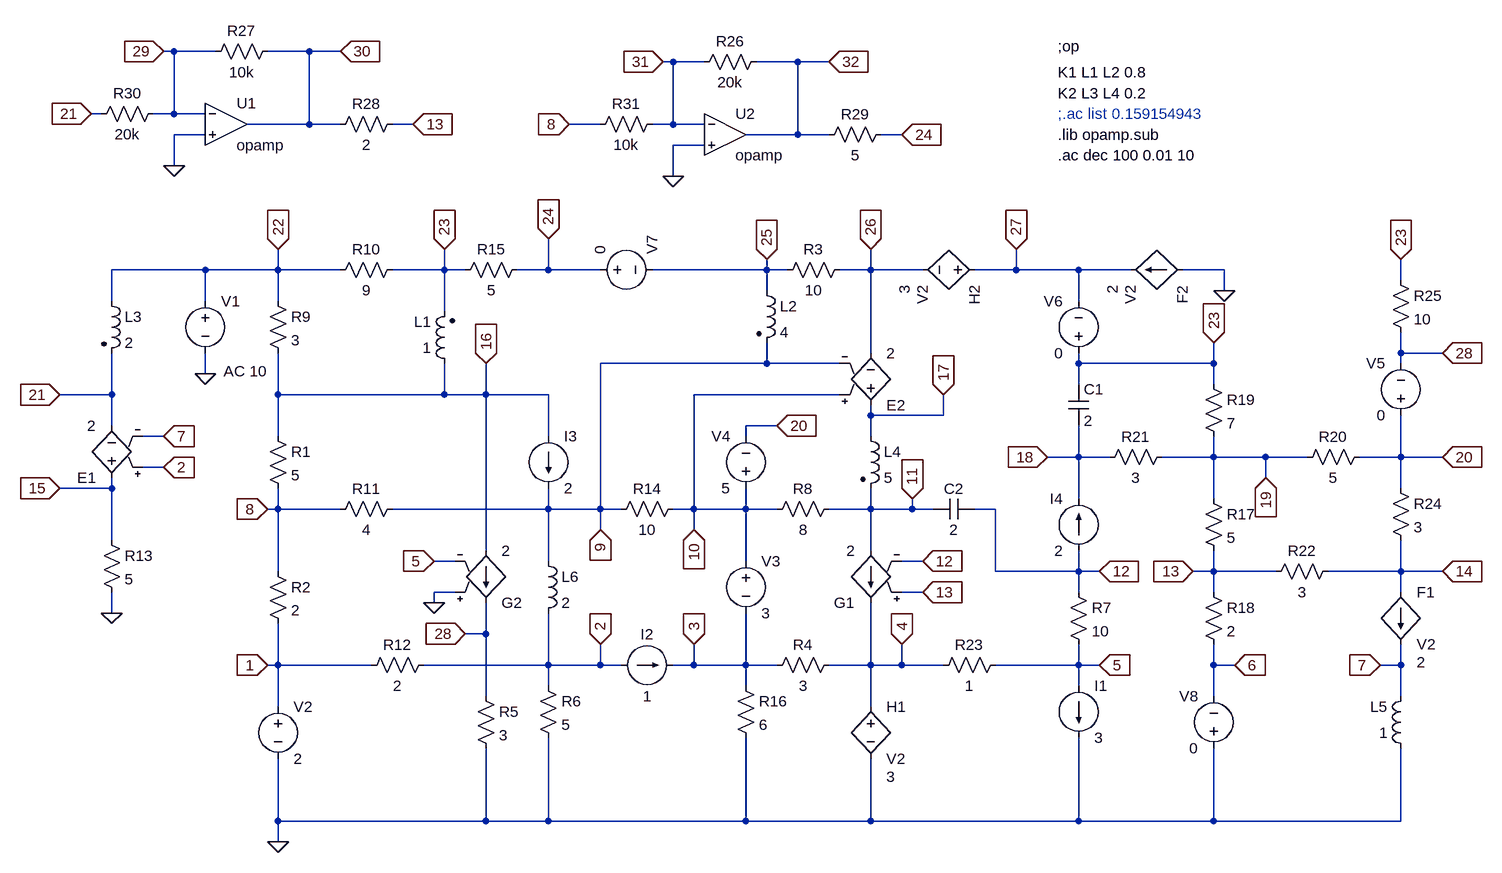
[diagram p0: schematic test_8.asc]
test_8.asc, the LTspice schematic file:
Version 4
SHEET 1 2008 704
WIRE -80 -752 -96 -752
WIRE -16 -752 -80 -752
WIRE 128 -752 64 -752
WIRE 176 -752 128 -752
WIRE 688 -736 672 -736
WIRE 736 -736 688 -736
WIRE 880 -736 816 -736
WIRE 928 -736 880 -736
WIRE -192 -656 -208 -656
WIRE -80 -656 -80 -752
WIRE -80 -656 -112 -656
WIRE -32 -656 -80 -656
WIRE 128 -640 128 -752
WIRE 128 -640 32 -640
WIRE 176 -640 128 -640
WIRE 288 -640 256 -640
WIRE 576 -640 528 -640
WIRE 688 -640 688 -736
WIRE 688 -640 656 -640
WIRE 736 -640 688 -640
WIRE -32 -624 -80 -624
WIRE 880 -624 880 -736
WIRE 880 -624 800 -624
WIRE 928 -624 880 -624
WIRE 1040 -624 1008 -624
WIRE 736 -608 688 -608
WIRE -80 -576 -80 -624
WIRE 688 -560 688 -608
WIRE -32 -416 -176 -416
WIRE 80 -416 80 -448
WIRE 80 -416 -32 -416
WIRE 176 -416 80 -416
WIRE 336 -416 336 -448
WIRE 336 -416 256 -416
WIRE 368 -416 336 -416
WIRE 496 -416 496 -464
WIRE 496 -416 448 -416
WIRE 576 -416 496 -416
WIRE 832 -416 832 -432
WIRE 832 -416 656 -416
WIRE 864 -416 832 -416
WIRE 992 -416 992 -448
WIRE 992 -416 944 -416
WIRE 1072 -416 992 -416
WIRE 1216 -416 1216 -448
WIRE 1216 -416 1152 -416
WIRE 1312 -416 1216 -416
WIRE 1392 -416 1312 -416
WIRE 1536 -416 1472 -416
WIRE 1808 -400 1808 -432
WIRE 832 -384 832 -416
WIRE 1536 -384 1536 -416
WIRE -176 -368 -176 -416
WIRE -32 -368 -32 -416
WIRE 80 -368 80 -416
WIRE 1312 -368 1312 -416
WIRE 336 -352 336 -416
WIRE 992 -288 992 -416
WIRE 1808 -288 1808 -320
WIRE 1872 -288 1808 -288
WIRE 832 -272 832 -304
WIRE 832 -272 576 -272
WIRE 944 -272 832 -272
WIRE 1312 -272 1312 -288
WIRE 1520 -272 1520 -304
WIRE 1520 -272 1312 -272
WIRE 1808 -272 1808 -288
WIRE -32 -256 -32 -288
WIRE 1312 -240 1312 -272
WIRE 1520 -240 1520 -272
WIRE -176 -224 -176 -288
WIRE -176 -224 -256 -224
WIRE 80 -224 80 -288
WIRE 336 -224 336 -272
WIRE 336 -224 80 -224
WIRE 400 -224 400 -272
WIRE 400 -224 336 -224
WIRE 496 -224 400 -224
WIRE 944 -224 720 -224
WIRE 992 -192 992 -208
WIRE 1104 -192 1104 -224
WIRE 1104 -192 992 -192
WIRE -176 -176 -176 -224
WIRE 848 -176 800 -176
WIRE -96 -160 -128 -160
WIRE 80 -160 80 -224
WIRE 496 -160 496 -224
WIRE 800 -160 800 -176
WIRE 992 -160 992 -192
WIRE 1312 -128 1312 -176
WIRE 1312 -128 1264 -128
WIRE 1360 -128 1312 -128
WIRE 1520 -128 1520 -160
WIRE 1520 -128 1440 -128
WIRE 1600 -128 1520 -128
WIRE 1664 -128 1600 -128
WIRE 1808 -128 1808 -192
WIRE 1808 -128 1744 -128
WIRE 1872 -128 1808 -128
WIRE -96 -112 -128 -112
WIRE 1600 -96 1600 -128
WIRE -176 -80 -176 -96
WIRE -176 -80 -256 -80
WIRE 1808 -80 1808 -128
WIRE 1312 -64 1312 -128
WIRE 1520 -64 1520 -128
WIRE 80 -48 80 -80
WIRE 80 -48 64 -48
WIRE 176 -48 80 -48
WIRE 496 -48 496 -80
WIRE 496 -48 256 -48
WIRE 576 -48 576 -272
WIRE 576 -48 496 -48
WIRE 608 -48 576 -48
WIRE 720 -48 720 -224
WIRE 720 -48 688 -48
WIRE 800 -48 800 -80
WIRE 800 -48 720 -48
WIRE 848 -48 800 -48
WIRE 992 -48 992 -80
WIRE 992 -48 928 -48
WIRE 1056 -48 1056 -64
WIRE 1056 -48 992 -48
WIRE 1088 -48 1056 -48
WIRE 1184 -48 1152 -48
WIRE 576 -16 576 -48
WIRE 720 -16 720 -48
WIRE -176 0 -176 -80
WIRE 400 16 400 -224
WIRE 992 16 992 -48
WIRE 352 32 320 32
WIRE 496 32 496 -48
WIRE 800 32 800 -48
WIRE 1072 32 1040 32
WIRE 80 48 80 -48
WIRE 1184 48 1184 -48
WIRE 1312 48 1312 16
WIRE 1312 48 1184 48
WIRE 1344 48 1312 48
WIRE 1520 48 1520 16
WIRE 1520 48 1488 48
WIRE 1616 48 1520 48
WIRE 1808 48 1808 0
WIRE 1808 48 1696 48
WIRE 1872 48 1808 48
WIRE 352 80 320 80
WIRE 1072 80 1040 80
WIRE 1312 80 1312 48
WIRE 1520 80 1520 48
WIRE 1808 80 1808 48
WIRE 320 96 320 80
WIRE -176 112 -176 80
WIRE 400 144 400 96
WIRE 400 144 368 144
WIRE 80 192 80 128
WIRE 80 192 64 192
WIRE 224 192 80 192
WIRE 496 192 496 112
WIRE 496 192 304 192
WIRE 576 192 576 160
WIRE 576 192 496 192
WIRE 608 192 576 192
WIRE 720 192 720 160
WIRE 720 192 688 192
WIRE 800 192 800 112
WIRE 800 192 720 192
WIRE 848 192 800 192
WIRE 992 192 992 96
WIRE 992 192 928 192
WIRE 1040 192 1040 160
WIRE 1040 192 992 192
WIRE 1104 192 1040 192
WIRE 1312 192 1312 160
WIRE 1312 192 1184 192
WIRE 1344 192 1312 192
WIRE 1520 192 1520 160
WIRE 1552 192 1520 192
WIRE 1808 192 1808 160
WIRE 1808 192 1776 192
WIRE 496 224 496 192
WIRE 800 224 800 192
WIRE 1312 224 1312 192
WIRE 400 240 400 144
WIRE 1520 240 1520 192
WIRE 1808 240 1808 192
WIRE 80 256 80 192
WIRE 992 256 992 192
WIRE 80 432 80 336
WIRE 400 432 400 320
WIRE 400 432 80 432
WIRE 496 432 496 304
WIRE 496 432 400 432
WIRE 800 432 800 304
WIRE 800 432 496 432
WIRE 992 432 992 336
WIRE 992 432 800 432
WIRE 1312 432 1312 304
WIRE 1312 432 992 432
WIRE 1520 432 1520 320
WIRE 1520 432 1312 432
WIRE 1808 432 1808 320
WIRE 1808 432 1520 432
WIRE 80 464 80 432
FLAG 80 464 0
FLAG 64 192 1
IOPIN 64 192 In
FLAG 64 -48 8
IOPIN 64 -48 In
FLAG 80 -448 22
IOPIN 80 -448 In
FLAG 336 -448 23
IOPIN 336 -448 In
FLAG 832 -432 25
IOPIN 832 -432 In
FLAG 1216 -448 27
IOPIN 1216 -448 In
FLAG 1344 48 12
IOPIN 1344 48 In
FLAG 1344 192 5
IOPIN 1344 192 In
FLAG 720 -16 10
IOPIN 720 -16 In
FLAG 720 160 3
IOPIN 720 160 In
FLAG 576 -16 9
IOPIN 576 -16 In
FLAG 576 160 2
IOPIN 576 160 In
FLAG 320 96 0
FLAG 320 32 5
IOPIN 320 32 In
FLAG 1072 32 12
IOPIN 1072 32 In
FLAG 1072 80 13
IOPIN 1072 80 In
FLAG 1552 192 6
IOPIN 1552 192 In
FLAG 1488 48 13
IOPIN 1488 48 In
FLAG 1808 -432 23
IOPIN 1808 -432 In
FLAG 1536 -384 0
FLAG -96 -160 7
IOPIN -96 -160 In
FLAG -96 -112 2
IOPIN -96 -112 In
FLAG -32 -256 0
FLAG -176 112 0
FLAG 848 -176 20
IOPIN 848 -176 In
FLAG 1040 160 4
IOPIN 1040 160 In
FLAG 1776 192 7
IOPIN 1776 192 In
FLAG 1872 48 14
IOPIN 1872 48 In
FLAG 1056 -64 11
IOPIN 1056 -64 In
FLAG 992 -448 26
IOPIN 992 -448 In
FLAG 1264 -128 18
IOPIN 1264 -128 In
FLAG 1520 -304 23
IOPIN 1520 -304 In
FLAG 1872 -128 20
IOPIN 1872 -128 In
FLAG 1872 -288 28
IOPIN 1872 -288 In
FLAG 496 -464 24
IOPIN 496 -464 In
FLAG -256 -224 21
IOPIN -256 -224 In
FLAG -256 -80 15
IOPIN -256 -80 In
FLAG 400 -272 16
IOPIN 400 -272 In
FLAG 1600 -96 19
IOPIN 1600 -96 In
FLAG 1104 -224 17
IOPIN 1104 -224 In
FLAG 368 144 28
IOPIN 368 144 In
FLAG -208 -656 21
IOPIN -208 -656 In
FLAG 288 -640 13
IOPIN 288 -640 In
FLAG 528 -640 8
IOPIN 528 -640 In
FLAG 1040 -624 24
IOPIN 1040 -624 In
FLAG 688 -560 0
FLAG -80 -576 0
FLAG 176 -752 30
IOPIN 176 -752 In
FLAG 928 -736 32
IOPIN 928 -736 In
FLAG 672 -736 31
IOPIN 672 -736 In
FLAG -96 -752 29
IOPIN -96 -752 In
SYMBOL res 64 -176 R0
SYMATTR InstName R1
SYMATTR Value 5
SYMBOL res 64 32 R0
SYMATTR InstName R2
SYMATTR Value 2
SYMBOL res 480 208 R0
SYMATTR InstName R6
SYMATTR Value 5
SYMBOL res 944 -64 R90
WINDOW 0 0 56 VBottom 2
WINDOW 3 32 56 VTop 2
SYMATTR InstName R8
SYMATTR Value 8
SYMBOL res 272 -432 R90
WINDOW 0 0 56 VBottom 2
WINDOW 3 32 56 VTop 2
SYMATTR InstName R10
SYMATTR Value 9
SYMBOL res 272 -64 R90
WINDOW 0 0 56 VBottom 2
WINDOW 3 32 56 VTop 2
SYMATTR InstName R11
SYMATTR Value 4
SYMBOL res 320 176 R90
WINDOW 0 0 56 VBottom 2
WINDOW 3 32 56 VTop 2
SYMATTR InstName R12
SYMATTR Value 2
SYMBOL res 704 -64 R90
WINDOW 0 0 56 VBottom 2
WINDOW 3 32 56 VTop 2
SYMATTR InstName R14
SYMATTR Value 10
SYMBOL res 464 -432 R90
WINDOW 0 0 56 VBottom 2
WINDOW 3 32 56 VTop 2
SYMATTR InstName R15
SYMATTR Value 5
SYMBOL voltage -32 -384 R0
WINDOW 123 28 124 Left 2
WINDOW 39 0 0 Left 2
SYMATTR Value2 AC 10
SYMATTR InstName V1
SYMATTR Value ""
SYMBOL voltage 80 240 R0
WINDOW 123 0 0 Left 2
WINDOW 39 0 0 Left 2
SYMATTR InstName V2
SYMATTR Value 2
SYMBOL voltage 800 16 R0
WINDOW 123 0 0 Left 2
WINDOW 39 0 0 Left 2
SYMATTR InstName V3
SYMATTR Value 3
SYMBOL voltage 800 -64 R180
WINDOW 0 24 96 Left 2
WINDOW 3 24 16 Left 2
WINDOW 123 0 0 Left 2
WINDOW 39 0 0 Left 2
SYMATTR InstName V4
SYMATTR Value 5
SYMBOL current 1312 224 R0
WINDOW 123 0 0 Left 2
WINDOW 39 0 0 Left 2
SYMATTR InstName I1
SYMATTR Value 3
SYMBOL current 608 192 R270
WINDOW 0 32 40 VTop 2
WINDOW 3 -32 40 VBottom 2
WINDOW 123 0 0 Left 2
WINDOW 39 0 0 Left 2
SYMATTR InstName I2
SYMATTR Value 1
SYMBOL current 496 -160 R0
WINDOW 123 0 0 Left 2
WINDOW 39 0 0 Left 2
SYMATTR InstName I3
SYMATTR Value 2
SYMBOL current 1312 16 R180
WINDOW 0 24 80 Left 2
WINDOW 3 24 0 Left 2
WINDOW 123 0 0 Left 2
WINDOW 39 0 0 Left 2
SYMATTR InstName I4
SYMATTR Value 2
SYMBOL res 1296 64 R0
SYMATTR InstName R7
SYMATTR Value 10
SYMBOL res 784 208 R0
SYMATTR InstName R16
SYMATTR Value 6
SYMBOL res 960 -432 R90
WINDOW 0 0 56 VBottom 2
WINDOW 3 32 56 VTop 2
SYMATTR InstName R3
SYMATTR Value 10
SYMBOL res 944 176 R90
WINDOW 0 0 56 VBottom 2
WINDOW 3 32 56 VTop 2
SYMATTR InstName R4
SYMATTR Value 3
SYMBOL f 1808 80 R0
WINDOW 123 24 108 Left 2
SYMATTR Value2 2
SYMATTR InstName F1
SYMATTR Value V2
SYMBOL e -176 -80 R180
SYMATTR InstName E1
SYMATTR Value 2
SYMBOL h 992 240 R0
WINDOW 123 24 124 Left 2
SYMATTR Value2 3
SYMATTR InstName H1
SYMATTR Value V2
SYMBOL g 992 112 R180
SYMATTR InstName G1
SYMATTR Value 2
SYMBOL ind2 352 -256 R180
WINDOW 0 36 80 Left 2
WINDOW 3 36 40 Left 2
SYMATTR InstName L1
SYMATTR Value 1
SYMATTR Type ind
SYMATTR SpiceLine Rser=0
SYMBOL ind2 816 -400 R0
SYMATTR InstName L2
SYMATTR Value 4
SYMATTR Type ind
SYMATTR SpiceLine Rser=0
SYMBOL voltage 1808 -176 R180
WINDOW 0 24 96 Left 2
WINDOW 3 24 16 Left 2
WINDOW 123 0 0 Left 2
WINDOW 39 0 0 Left 2
SYMATTR InstName V5
SYMATTR Value 0
SYMBOL voltage 1312 -272 R180
WINDOW 0 24 96 Left 2
WINDOW 3 24 16 Left 2
WINDOW 123 0 0 Left 2
WINDOW 39 0 0 Left 2
SYMATTR InstName V6
SYMATTR Value 0
SYMBOL ind2 -192 -384 R0
SYMATTR InstName L3
SYMATTR Type ind
SYMATTR Value 2
SYMATTR SpiceLine Rser=0
SYMBOL ind2 976 -176 R0
SYMATTR InstName L4
SYMATTR Type ind
SYMATTR Value 5
SYMATTR SpiceLine Rser=0
SYMBOL cap 1296 -240 R0
SYMATTR InstName C1
SYMATTR Value 2
SYMBOL cap 1152 -64 R90
WINDOW 0 0 32 VBottom 2
WINDOW 3 32 32 VTop 2
SYMATTR InstName C2
SYMATTR Value 2
SYMBOL ind 1824 336 R180
WINDOW 0 36 80 Left 2
WINDOW 3 36 40 Left 2
SYMATTR InstName L5
SYMATTR Value 1
SYMATTR SpiceLine Rser=0
SYMBOL ind 480 16 R0
SYMATTR InstName L6
SYMATTR Value 2
SYMATTR SpiceLine Rser=0
SYMBOL f 1472 -416 R90
WINDOW 123 24 108 Left 2
SYMATTR Value2 2
SYMATTR InstName F2
SYMATTR Value V2
SYMBOL e 992 -192 M180
SYMATTR InstName E2
SYMATTR Value 2
SYMBOL h 1168 -416 R90
WINDOW 123 24 124 Left 2
SYMATTR Value2 3
SYMATTR InstName H2
SYMATTR Value V2
SYMBOL g 400 112 M180
SYMATTR InstName G2
SYMATTR Value 2
SYMBOL voltage 560 -416 R270
WINDOW 0 24 96 Left 2
WINDOW 3 24 16 Left 2
WINDOW 123 0 0 Left 2
WINDOW 39 0 0 Left 2
SYMATTR InstName V7
SYMATTR Value 0
SYMBOL voltage 1520 336 R180
WINDOW 0 24 96 Left 2
WINDOW 3 24 16 Left 2
WINDOW 123 0 0 Left 2
WINDOW 39 0 0 Left 2
SYMATTR InstName V8
SYMATTR Value 0
SYMBOL res 64 -384 R0
SYMATTR InstName R9
SYMATTR Value 3
SYMBOL res -192 -16 R0
SYMATTR InstName R13
SYMATTR Value 5
SYMBOL res 1504 -80 R0
SYMATTR InstName R17
SYMATTR Value 5
SYMBOL res 1504 64 R0
SYMATTR InstName R18
SYMATTR Value 2
SYMBOL res 1504 -256 R0
SYMATTR InstName R19
SYMATTR Value 7
SYMBOL res 1760 -144 R90
WINDOW 0 0 56 VBottom 2
WINDOW 3 32 56 VTop 2
SYMATTR InstName R20
SYMATTR Value 5
SYMBOL res 1456 -144 R90
WINDOW 0 0 56 VBottom 2
WINDOW 3 32 56 VTop 2
SYMATTR InstName R21
SYMATTR Value 3
SYMBOL res 1712 32 R90
WINDOW 0 0 56 VBottom 2
WINDOW 3 32 56 VTop 2
SYMATTR InstName R22
SYMATTR Value 3
SYMBOL res 1200 176 R90
WINDOW 0 0 56 VBottom 2
WINDOW 3 32 56 VTop 2
SYMATTR InstName R23
SYMATTR Value 1
SYMBOL res 1792 -96 R0
SYMATTR InstName R24
SYMATTR Value 3
SYMBOL res 1792 -416 R0
SYMATTR InstName R25
SYMATTR Value 10
SYMBOL res 384 224 R0
SYMATTR InstName R5
SYMATTR Value 3
SYMBOL res 832 -752 R90
WINDOW 0 0 56 VBottom 2
WINDOW 3 32 56 VTop 2
SYMATTR InstName R26
SYMATTR Value 20k
SYMBOL res 80 -768 R90
WINDOW 0 0 56 VBottom 2
WINDOW 3 32 56 VTop 2
SYMATTR InstName R27
SYMATTR Value 10k
SYMBOL res 272 -656 R90
WINDOW 0 0 56 VBottom 2
WINDOW 3 32 56 VTop 2
SYMATTR InstName R28
SYMATTR Value 2
SYMBOL res 1024 -640 R90
WINDOW 0 0 56 VBottom 2
WINDOW 3 32 56 VTop 2
SYMATTR InstName R29
SYMATTR Value 5
SYMBOL res -96 -672 R90
WINDOW 0 0 56 VBottom 2
WINDOW 3 32 56 VTop 2
SYMATTR InstName R30
SYMATTR Value 20k
SYMBOL res 672 -656 R90
WINDOW 0 0 56 VBottom 2
WINDOW 3 32 56 VTop 2
SYMATTR InstName R31
SYMATTR Value 10k
SYMBOL OpAmps\\opamp 0 -704 R0
SYMATTR InstName U1
SYMBOL OpAmps\\opamp 768 -688 R0
SYMATTR InstName U2
TEXT 1280 -760 Left 2 !;op
TEXT 1280 -720 Left 2 !K1 L1 L2 0.8
TEXT 1280 -688 Left 2 !K2 L3 L4 0.2
TEXT 1280 -656 Left 2 ;;.ac list 0.159154943
TEXT 1280 -624 Left 2 !.lib opamp.sub
TEXT 1280 -592 Left 2 !.ac dec 100 0.01 10

The netlist it stands for:
* test_8.asc
R1 16 8 5
R2 8 1 2
R6 2 0 5
R8 11 10 8
R10 23 22 9
R11 9 8 4
R12 2 1 2
R14 10 9 10
R15 24 23 5
V1 22 0 AC 10
V2 1 0 2
V3 10 3 3
V4 10 20 5
I1 5 0 3
I2 2 3 1
I3 16 9 2
I4 12 18 2
R7 12 5 10
R16 3 0 6
R3 26 25 10
R4 4 3 3
F1 14 7 V2 2
E1 15 21 2 7 2
H1 4 0 V2 3
G1 11 4 13 12 2
L1 16 23 1 Rser=0
L2 25 9 4 Rser=0
V5 20 28 0
V6 23 27 0
L3 22 21 2 Rser=0
L4 17 11 5 Rser=0
C1 23 18 2
C2 12 11 2
L5 0 7 1 Rser=0
L6 9 2 2 Rser=0
F2 0 27 V2 2
E2 17 26 10 9 2
H2 27 26 V2 3
G2 16 28 0 5 2
V7 24 25 0
V8 0 6 0
R9 22 16 3
R13 15 0 5
R17 19 13 5
R18 13 6 2
R19 23 19 7
R20 20 19 5
R21 19 18 3
R22 14 13 3
R23 5 4 1
R24 20 14 3
R25 23 28 10
R5 28 0 3
R26 32 31 20k
R27 30 29 10k
R28 13 30 2
R29 24 32 5
R30 29 21 20k
R31 31 8 10k
XU1 29 0 30 opamp Aol=100K GBW=10Meg  ; pins invin noninvin out
XU2 31 0 32 opamp Aol=100K GBW=10Meg  ; pins invin noninvin out
;op
K1 L1 L2 0.8
K2 L3 L4 0.2
* ;.ac list 0.159154943
.lib opamp.sub
.ac dec 100 0.01 10
.backanno
.end